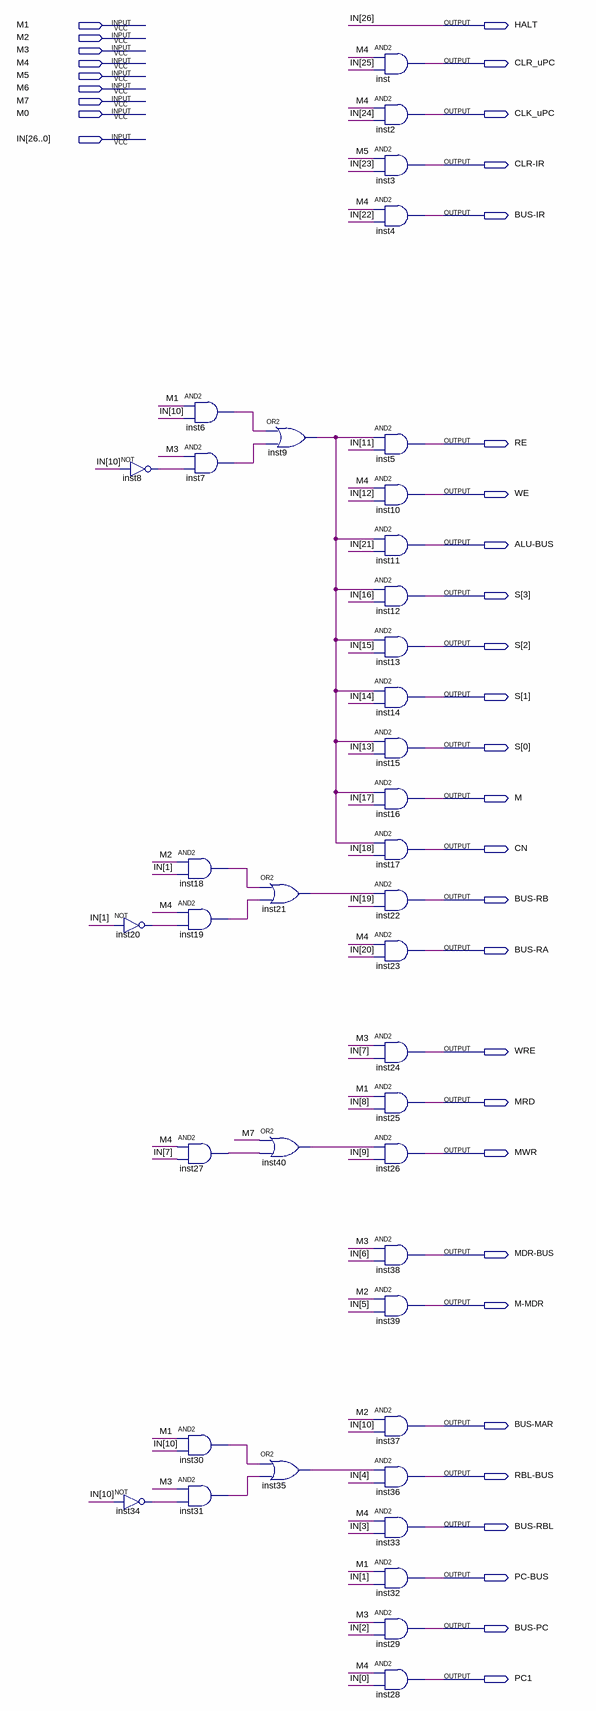
[diagram p0: schematic sheet]
// Quartus schematic CU.bdf as structural Verilog: 40 symbols, 36 pins
module CU (
  input  M1,
  input  M2,
  input  M3,
  input  M4,
  input  M5,
  input  M6,
  input  M7,
  input  M0,
  input  [26:0] IN,
  output HALT,
  output CLR_uPC,
  output CLK_uPC,
  output \CLR-IR ,
  output \BUS-IR ,
  output RE,
  output WE,
  output \ALU-BUS ,
  output [3:0] S,
  output M,
  output CN,
  output \BUS-RB ,
  output \BUS-RA ,
  output WRE,
  output MRD,
  output MWR,
  output \MDR-BUS ,
  output \M-MDR ,
  output \BUS-MAR ,
  output \RBL-BUS ,
  output \BUS-RBL ,
  output \PC-BUS ,
  output \BUS-PC ,
  output PC1
);

  wire inst6_out, inst7_out, inst8_out, inst9_out, inst18_out, inst19_out, inst20_out, inst21_out,
       inst27_out, inst30_out, inst31_out, inst34_out, inst35_out, inst40_out;

  not inst20 (inst20_out, IN[1]);
  not inst34 (inst34_out, IN[10]);
  not inst8 (inst8_out, IN[10]);
  and inst6 (inst6_out, M1, IN[10]);
  and inst7 (inst7_out, M3, inst8_out);
  and inst18 (inst18_out, M2, IN[1]);
  and inst19 (inst19_out, M4, inst20_out);
  and inst27 (inst27_out, M4, IN[7]);
  and inst30 (inst30_out, M1, IN[10]);
  and inst31 (inst31_out, M3, inst34_out);
  or inst9 (inst9_out, inst6_out, inst7_out);
  or inst21 (inst21_out, inst18_out, inst19_out);
  or inst40 (inst40_out, M7, inst27_out);
  or inst35 (inst35_out, inst30_out, inst31_out);
  and inst (CLR_uPC, M4, IN[25]);
  and inst2 (CLK_uPC, M4, IN[24]);
  and inst3 (\CLR-IR , M5, IN[23]);
  and inst4 (\BUS-IR , M4, IN[22]);
  and inst5 (RE, inst9_out, IN[11]);
  and inst10 (WE, M4, IN[12]);
  and inst11 (\ALU-BUS , inst9_out, IN[21]);
  and inst12 (S[3], inst9_out, IN[16]);
  and inst13 (S[2], inst9_out, IN[15]);
  and inst14 (S[1], inst9_out, IN[14]);
  and inst15 (S[0], inst9_out, IN[13]);
  and inst16 (M, inst9_out, IN[17]);
  and inst17 (CN, inst9_out, IN[18]);
  and inst22 (\BUS-RB , inst21_out, IN[19]);
  and inst23 (\BUS-RA , M4, IN[20]);
  and inst24 (WRE, M3, IN[7]);
  and inst25 (MRD, M1, IN[8]);
  and inst26 (MWR, inst40_out, IN[9]);
  and inst38 (\MDR-BUS , M3, IN[6]);
  and inst39 (\M-MDR , M2, IN[5]);
  and inst37 (\BUS-MAR , M2, IN[10]);
  and inst36 (\RBL-BUS , inst35_out, IN[4]);
  and inst33 (\BUS-RBL , M4, IN[3]);
  and inst32 (\PC-BUS , M1, IN[1]);
  and inst29 (\BUS-PC , M3, IN[2]);
  and inst28 (PC1, M4, IN[0]);

  assign HALT = IN[26];
endmodule
